# EAGLE schematic pressure_sensor (EAGLE 7.5.0)
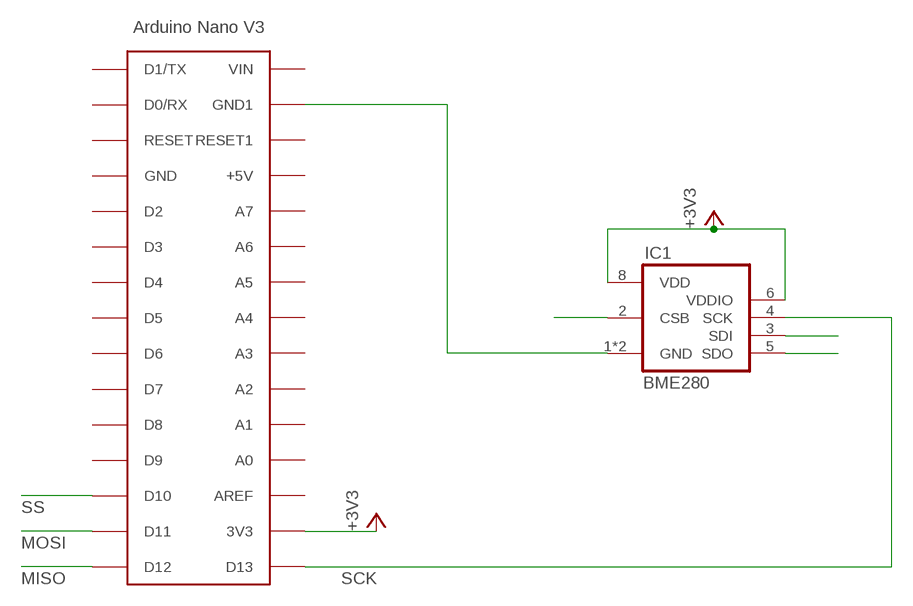
[diagram p0: schematic, sheet 1]

## Parts
IC1  BME280  [BME280]
U$1  ARDUINONANO  [PDIP-32]

## Nets
+3V3: IC1.6(VDDIO) IC1.8(VDD) U$1.3V3
MISO: IC1.5(SDO) U$1.D12
MOSI: IC1.3(SDI) U$1.D11
N$2: IC1.1(GND) IC1.7(GND) U$1.GND1
N$4: IC1.4(SCK) U$1.D13
SS: IC1.2(CSB) U$1.D10
Unconnected: U$1.+5V U$1.A0(A7) U$1.A1(A6) U$1.A2(A5) U$1.A3(A4) U$1.A4(A3) U$1.A5(A2) U$1.A6(A1) U$1.A7(A0) U$1.AREF U$1.D0/RX U$1.D1/TX U$1.D2 U$1.D3 U$1.D4 U$1.D5 U$1.D6 U$1.D7 U$1.D8 U$1.D9 U$1.GND U$1.RESET U$1.RESET1 U$1.VIN

## Notes on the sheet
- SS
- MOSI
- MISO | SCK

## Library data of the parts
IC1 = bosch-bme280:BME280: DIGITAL HUMIDITY, PRESSURE AND TEMPERATURE SENSOR * Digital interface I²C (up to 3.4 MHz) and SPI (3 and 4 wire, up to 10 MHz)* Supply voltage VDD main supply voltage range: 1.71 V to 3.6 V*VDDIO interface voltage range: 1.2 V to 3.6 V Operating range -40…+85 °C, 0…100 % rel. humidity, 300…1100 hPa The library has been designed by Richard Magdycz <https://www.facebook.com/groups/eaglecadsoftUK>
U$1 = CRE-Lib1:ARDUINONANO: Arduino Nano